# EAGLE design e-wall (EAGLE 6.4)
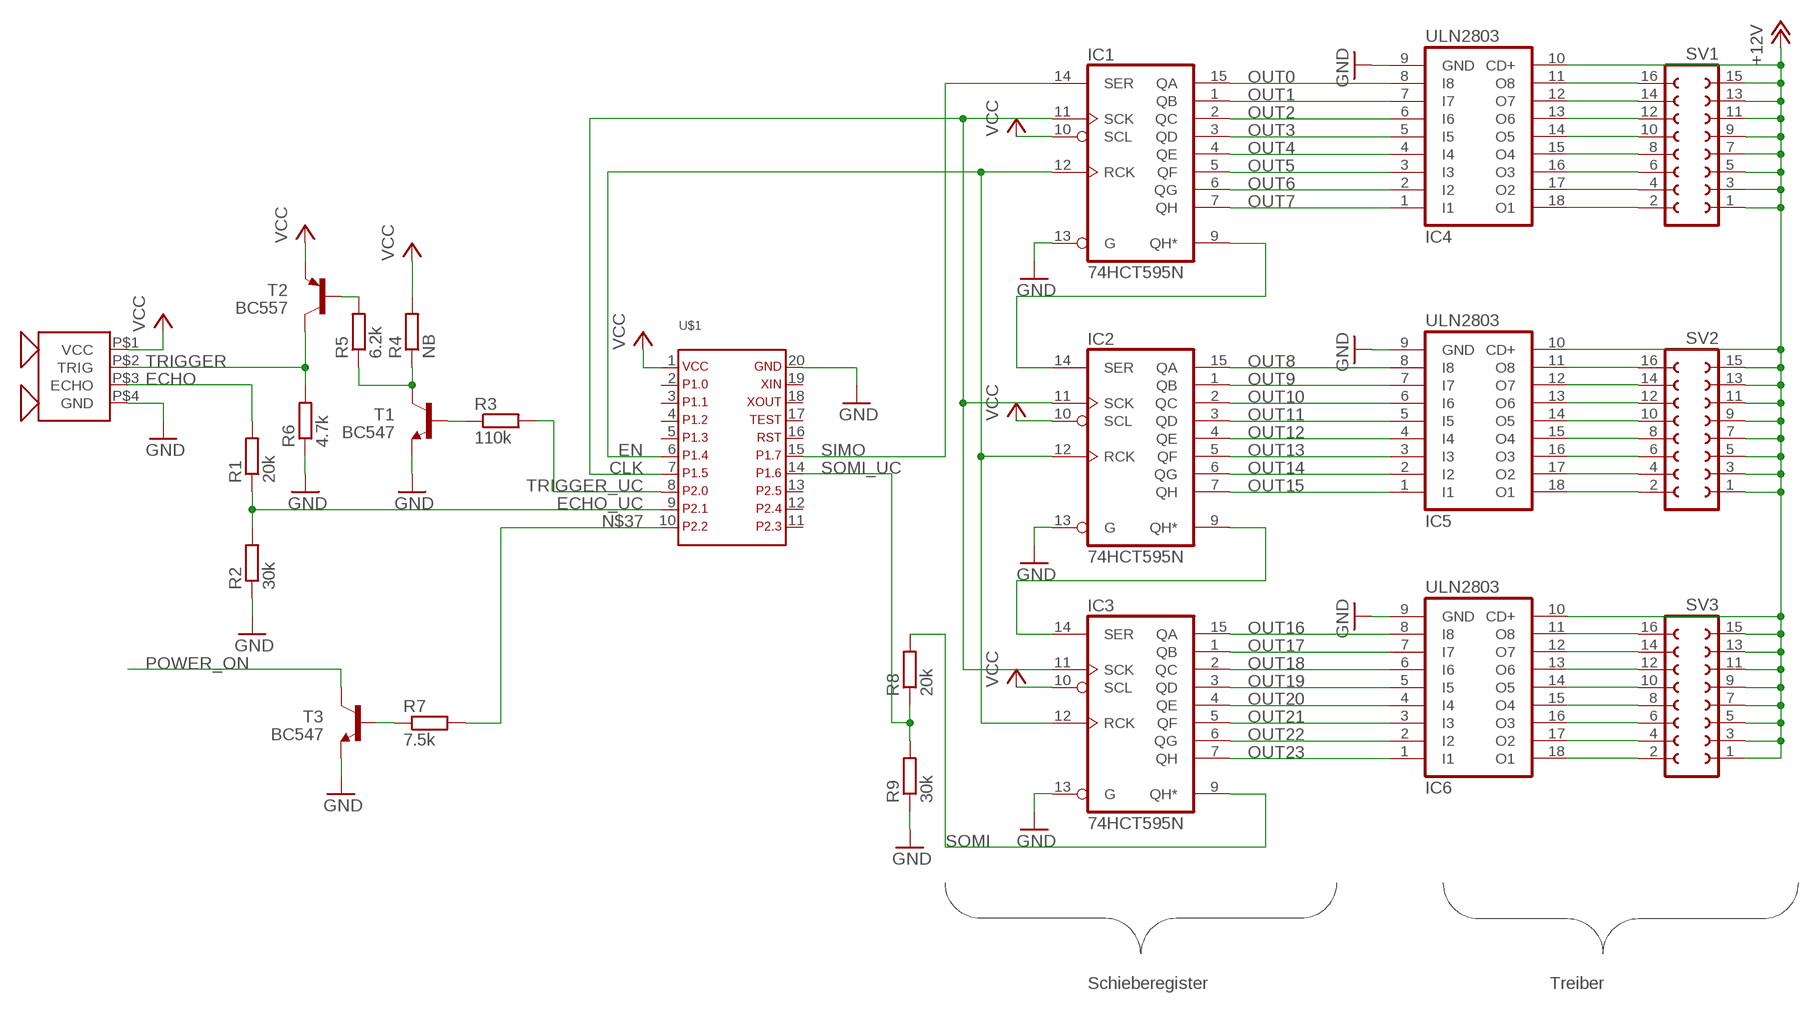
[diagram p0: schematic, sheet 1]

## Parts
IC1  74HCT595N  [DIL16]
IC2  74HCT595N  [DIL16]
IC3  74HCT595N  [DIL16]
IC4  ULN2803  ULN2803A  [DIL18]
IC5  ULN2803  ULN2803A  [DIL18]
IC6  ULN2803  ULN2803A  [DIL18]
R1  20k  R-EU_0207/7  [0207/7]
R2  30k  R-EU_0207/7  [0207/7]
R3  110k  R-EU_0207/7  [0207/7]
R4  NB  R-EU_0207/2V  [0207/2V]
R5  6.2k  R-EU_0207/2V  [0207/2V]
R6  4.7k  R-EU_0207/7  [0207/7]
R7  7.5k  R-EU_0207/7  [0207/7]
R8  20k  R-EU_0207/7  [0207/7]
R9  30k  R-EU_0207/7  [0207/7]
SV1  FE08-2  [FE08-2]
SV2  FE08-2  [FE08-2]
SV3  FE08-2  [FE08-2]
T1  BC547  -NPN-TO92-EBC  [TO92-EBC]
T2  BC557  -PNP-TO92-BEC  [TO92-BEC]
T3  BC547  -NPN-TO92-EBC  [TO92-EBC]
U$1  MSP430LAUNCHPAD_BASIC  [MSP430LAUNCHPAD_BASIC]
U$2  HC-SR04  [HC-SR04]

## Nets
+12V: IC4.10(CD+) IC5.10(CD+) IC6.10(CD+) SV1.1 SV1.3 SV1.5 SV1.7 SV1.9 SV1.11 SV1.13 SV1.15 SV2.1 SV2.3 SV2.5 SV2.7 SV2.9 SV2.11 SV2.13 SV2.15 SV3.1 SV3.3 SV3.5 SV3.7 SV3.9 SV3.11 SV3.13 SV3.15
CLK: IC1.11(SCK) IC2.11(SCK) IC3.11(SCK) U$1.7
ECHO: R1.2 U$2.P$3(ECHO)
ECHO_UC: R1.1 R2.2 U$1.9
EN: IC1.12(RCK) IC2.12(RCK) IC3.12(RCK) U$1.6
GND: IC1.13(G) IC2.13(G) IC3.13(G) IC4.9(GND) IC5.9(GND) IC6.9(GND) R2.1 R6.1 R9.1 T1.E T3.E U$1.20 U$2.P$4(GND)
N$1: IC1.9(QH*) IC2.14(SER)
N$2: IC2.9(QH*) IC3.14(SER)
N$3: IC6.18(O1) SV3.2
N$4: IC6.17(O2) SV3.4
N$5: IC6.16(O3) SV3.6
N$6: IC6.15(O4) SV3.8
N$7: IC6.14(O5) SV3.10
N$8: IC6.13(O6) SV3.12
N$9: IC6.12(O7) SV3.14
N$10: IC6.11(O8) SV3.16
N$11: IC5.18(O1) SV2.2
N$12: IC5.17(O2) SV2.4
N$13: IC5.16(O3) SV2.6
N$14: IC5.15(O4) SV2.8
N$15: IC5.14(O5) SV2.10
N$16: IC5.13(O6) SV2.12
N$17: IC5.12(O7) SV2.14
N$18: IC5.11(O8) SV2.16
N$19: IC4.18(O1) SV1.2
N$20: IC4.17(O2) SV1.4
N$21: IC4.16(O3) SV1.6
N$22: IC4.15(O4) SV1.8
N$23: IC4.14(O5) SV1.10
N$24: IC4.13(O6) SV1.12
N$25: IC4.12(O7) SV1.14
N$26: IC4.11(O8) SV1.16
N$33: R3.1 T1.B
N$34: R4.1 R5.1 T1.C
N$35: R5.2 T2.B
N$36: R7.1 T3.B
N$37: R7.2 U$1.10
OUT0: IC1.15(QA) IC4.8(I8)
OUT1: IC1.1(QB) IC4.7(I7)
OUT2: IC1.2(QC) IC4.6(I6)
OUT3: IC1.3(QD) IC4.5(I5)
OUT4: IC1.4(QE) IC4.4(I4)
OUT5: IC1.5(QF) IC4.3(I3)
OUT6: IC1.6(QG) IC4.2(I2)
OUT7: IC1.7(QH) IC4.1(I1)
OUT8: IC2.15(QA) IC5.8(I8)
OUT9: IC2.1(QB) IC5.7(I7)
OUT10: IC2.2(QC) IC5.6(I6)
OUT11: IC2.3(QD) IC5.5(I5)
OUT12: IC2.4(QE) IC5.4(I4)
OUT13: IC2.5(QF) IC5.3(I3)
OUT14: IC2.6(QG) IC5.2(I2)
OUT15: IC2.7(QH) IC5.1(I1)
OUT16: IC3.15(QA) IC6.8(I8)
OUT17: IC3.1(QB) IC6.7(I7)
OUT18: IC3.2(QC) IC6.6(I6)
OUT19: IC3.3(QD) IC6.5(I5)
OUT20: IC3.4(QE) IC6.4(I4)
OUT21: IC3.5(QF) IC6.3(I3)
OUT22: IC3.6(QG) IC6.2(I2)
OUT23: IC3.7(QH) IC6.1(I1)
POWER_ON: T3.C
SIMO: IC1.14(SER) U$1.15
SOMI: IC3.9(QH*) R8.2
SOMI_UC: R8.1 R9.2 U$1.14
TRIGGER: R6.2 T2.C U$2.P$2(TRIG)
TRIGGER_UC: R3.2 U$1.8
VCC: IC1.10(SCL) IC2.10(SCL) IC3.10(SCL) R4.2 T2.E U$1.1 U$2.P$1(VCC)
Unconnected: U$1.2 U$1.3 U$1.4 U$1.5 U$1.11 U$1.12 U$1.13 U$1.16 U$1.17 U$1.18 U$1.19

## Notes on the sheet
- Schieberegister | Treiber

## Power pins joined to a net without a drawn wire
GND: IC1.8(GND) IC2.8(GND) IC3.8(GND)
VCC: IC1.16(VCC) IC2.16(VCC) IC3.16(VCC)

## Library data of the parts
IC1-IC3 = 74xx-eu:74*595: 8-bit SHIFT REGISTER, output latch
IC4-IC6 = uln-udn:ULN2803A: DRIVER ARRAY
R1-R9 = resistor:R-EU_: RESISTOR, European symbol
SV1-SV3 = con-lsta:FE08-2: FEMALE HEADER; OC_FARNELL: unknown; OC_NEWARK: unknown
T1 T3 = transistor:*-NPN-: NPN Transistror BF959 corrected 2008.03.06
T2 = transistor:*-PNP-: PNP Transistror
U$1 = msp430launchpad:MSP430LAUNCHPAD_BASIC
U$2 = ultrasonic:HC-SR04

## Board
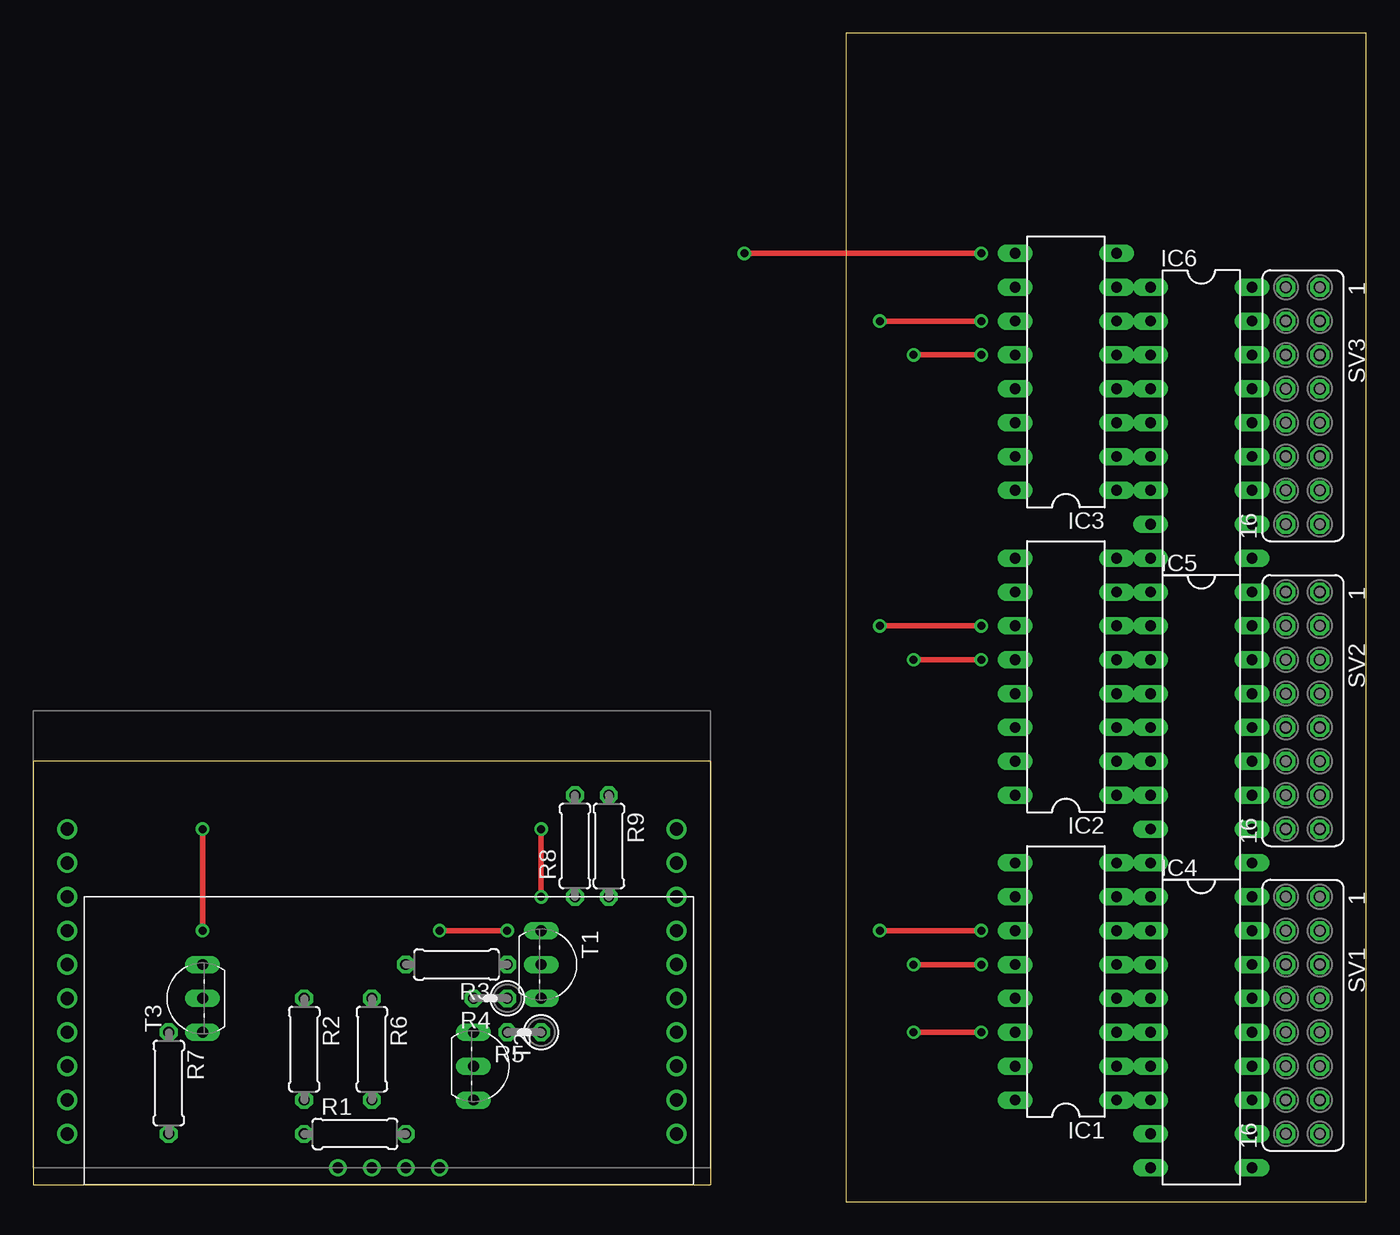
[diagram p1: board, top side]
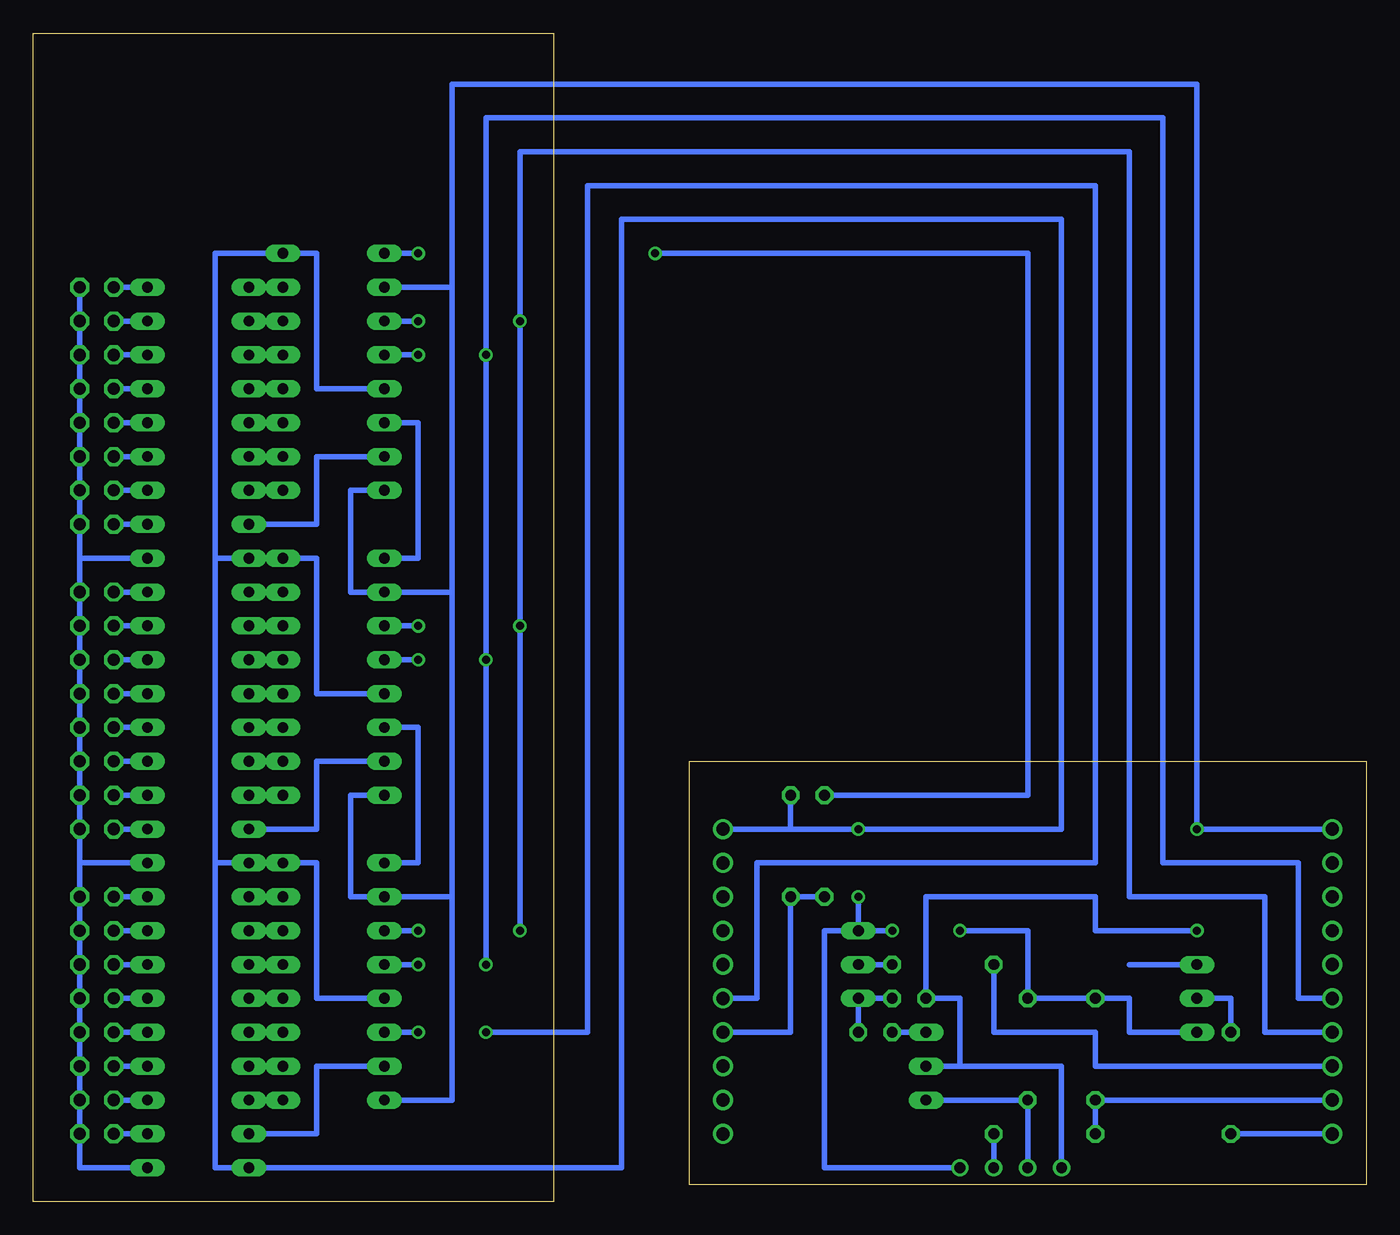
[diagram p2: board, bottom side, seen from below]

Size 100 x 87.62 mm. Coordinates in mm from the lower left corner, seen from the top.
Outline: 60.96,0 100,0 100,87.62 60.96,87.62 60.96,0
Outline: 50.8,33.02 0,33.02 0,1.27 50.8,1.27 50.8,33.02
Copper layers (1*16): Top 0.035mm / dielectric 1.5mm / Bottom 0.035mm
Design rules "default *": minimum track width 10mil, minimum drill 23mil, track to track 8mil, track to pad 8mil, pad to pad 8mil, via to via 8mil, smd to smd 8mil, copper to edge 20mil, drill to drill 8mil, minimum pad ring 10mil, minimum via ring 8mil, stop-mask expansion 4mil, vias tented up to drill 0mil, thermal gap 10mil

### Footprints (pad centres in the part's own frame; a part is rotated, then mirrored left to right if it is on the bottom)
DIL16 = drill 0.813 long: 1 -8.89,-3.81; 2 -6.35,-3.81; 3 -3.81,-3.81; 4 -1.27,-3.81; 5 1.27,-3.81; 6 3.81,-3.81; 7 6.35,-3.81; 8 8.89,-3.81; 9 8.89,3.81; 10 6.35,3.81; 11 3.81,3.81; 12 1.27,3.81; 13 -1.27,3.81; 14 -3.81,3.81; 15 -6.35,3.81; 16 -8.89,3.81
DIL18 = drill 0.813 long: 1 -10.16,-3.81; 2 -7.62,-3.81; 3 -5.08,-3.81; 4 -2.54,-3.81; 5 0,-3.81; 6 2.54,-3.81; 7 5.08,-3.81; 8 7.62,-3.81; 9 10.16,-3.81; 10 10.16,3.81; 11 7.62,3.81; 12 5.08,3.81; 13 2.54,3.81; 14 0,3.81; 15 -2.54,3.81; 16 -5.08,3.81; 17 -7.62,3.81; 18 -10.16,3.81
0207/7 = drill 0.813 octagon: 1 -3.81,0; 2 3.81,0
0207/2V = drill 0.813 octagon: 1 -1.27,0; 2 1.27,0
FE08-2 = drill 0.914 octagon: 1 -8.89,1.27; 2 -8.89,-1.27; 3 -6.35,1.27; 4 -6.35,-1.27; 5 -3.81,1.27; 6 -3.81,-1.27; 7 -1.27,1.27; 8 -1.27,-1.27; 9 1.27,1.27; 10 1.27,-1.27; 11 3.81,1.27; 12 3.81,-1.27; 13 6.35,1.27; 14 6.35,-1.27; 15 8.89,1.27; 16 8.89,-1.27
TO92-EBC = drill 0.813 long: B 0,-1.27; C 2.54,-1.27; E -2.54,-1.27
TO92-BEC = drill 0.813 long: B -2.54,0; C 2.54,0; E 0,0
MSP430LAUNCHPAD_BASIC = drill 1: 1 -22.86,11.43; 2 -22.86,8.89; 3 -22.86,6.35; 4 -22.86,3.81; 5 -22.86,1.27; 6 -22.86,-1.27; 7 -22.86,-3.81; 8 -22.86,-6.35; 9 -22.86,-8.89; 10 -22.86,-11.43; 11 22.86,-11.43; 12 22.86,-8.89; 13 22.86,-6.35; 14 22.86,-3.81; 15 22.86,-1.27; 16 22.86,1.27; 17 22.86,3.81; 18 22.86,6.35; 19 22.86,8.89; 20 22.86,11.43
HC-SR04 = drill 0.8: P$1 -3.81,0; P$2 -1.27,0; P$3 1.27,0; P$4 3.81,0

### Placement (x,y rotation side)
IC1  77.47,16.51 90 top
IC2  77.47,39.37 90 top
IC3  77.47,62.23 90 top
IC4  87.63,12.7 270 top
IC5  87.63,35.56 270 top
IC6  87.63,58.42 270 top
R1  24.13,5.08 0 top
R2  20.32,11.43 270 top
R3  31.75,17.78 180 top
R4  34.29,15.24 180 top
R5  36.83,12.7 180 top
R6  25.4,11.43 270 top
R7  10.16,8.89 270 top
R8  40.64,26.67 90 top
R9  43.18,26.67 270 top
SV1  95.25,13.97 270 top
SV2  95.25,36.83 270 top
SV3  95.25,59.69 270 top
T1  39.37,17.78 270 top
T2  33.02,10.16 270 top
T3  11.43,15.24 90 top
U$1  25.4,16.51 0 top
U$2  26.67,2.54 0 top

### Tracks (layer width: path | path; a pad name or v marks a point on that pad's centre or on a via)
+12V
  Bottom 0.406: IC6.10 96.52,48.26 | 96.52,48.26 SV3.15 SV3.13 SV3.11 SV3.9 SV3.7 SV3.5 SV3.3 SV3.1 | IC5.10 96.52,25.4 | 96.52,25.4 SV2.15 SV2.13 SV2.11 SV2.9 SV2.7 SV2.5 SV2.3 SV2.1 96.52,48.26 | 96.52,25.4 SV1.1 SV1.3 SV1.5 SV1.7 SV1.9 SV1.11 SV1.13 SV1.15 96.52,2.54 IC4.10
CLK  (via drill 0.6)
  Top 0.406: v71.12,43.18 v63.5,43.18 | v63.5,20.32 v71.12,20.32 | v71.12,66.04 v63.5,66.04
  Bottom 0.406: IC2.11 v71.12,43.18 | v63.5,20.32 v63.5,43.18 v63.5,66.04 63.5,78.74 17.78,78.74 17.78,22.86 7.62,22.86 7.62,12.7 U$1.7 | v71.12,20.32 IC1.11 | IC3.11 v71.12,66.04
ECHO
  Bottom 0.406: U$2.P$3 R1.2
ECHO_UC
  Bottom 0.406: R1.1 R2.2 U$1.9
EN  (via drill 0.6)
  Top 0.406: v71.12,40.64 v66.04,40.64 | v66.04,17.78 v71.12,17.78 | v71.12,63.5 v66.04,63.5
  Bottom 0.406: IC2.12 v71.12,40.64 | IC1.12 v71.12,17.78 | v66.04,17.78 v66.04,40.64 v66.04,63.5 66.04,81.28 15.24,81.28 15.24,25.4 5.08,25.4 5.08,15.24 U$1.6 | IC3.12 v71.12,63.5
GND  (via drill 0.6)
  Top 0.406: v38.1,22.86 v38.1,27.94 | v30.48,20.32 v35.56,20.32
  Bottom 0.406: 86.36,48.26 IC6.9 IC2.8 78.74,48.26 78.74,38.1 IC2.13 | 86.36,48.26 86.36,71.12 IC3.8 78.74,71.12 78.74,60.96 IC3.13 | 86.36,25.4 IC5.9 IC1.8 78.74,25.4 78.74,15.24 IC1.13 | 86.36,48.26 86.36,25.4 | 86.36,25.4 86.36,2.54 IC4.9 55.88,2.54 55.88,73.66 22.86,73.66 22.86,27.94 v38.1,27.94 43.18,27.94 | 43.18,27.94 R9.1 | U$2.P$4 40.64,2.54 40.64,20.32 T1.E | T3.E 17.78,12.7 17.78,15.24 R2.1 R6.1 25.4,20.32 v30.48,20.32 | v35.56,20.32 T1.E | T1.E v38.1,22.86 | U$1.20 43.18,27.94
N$1
  Bottom 0.406: IC1.9 71.12,25.4 71.12,35.56 IC2.14
N$2
  Bottom 0.406: IC2.9 71.12,48.26 71.12,58.42 IC3.14
N$3
  Bottom 0.406: IC6.18 SV3.2
N$4
  Bottom 0.406: IC6.17 SV3.4
N$5
  Bottom 0.406: SV3.6 IC6.16
N$6
  Bottom 0.406: SV3.8 IC6.15
N$7
  Bottom 0.406: IC6.14 SV3.10
N$8
  Bottom 0.406: IC6.13 SV3.12
N$9
  Bottom 0.406: IC6.12 SV3.14
N$10
  Bottom 0.406: IC6.11 SV3.16
N$11
  Bottom 0.406: IC5.18 SV2.2
N$12
  Bottom 0.406: IC5.17 SV2.4
N$13
  Bottom 0.406: IC5.16 SV2.6
N$14
  Bottom 0.406: IC5.15 SV2.8
N$15
  Bottom 0.406: IC5.14 SV2.10
N$16
  Bottom 0.406: IC5.13 SV2.12
N$17
  Bottom 0.406: IC5.12 SV2.14
N$18
  Bottom 0.406: IC5.11 SV2.16
N$19
  Bottom 0.406: IC4.18 SV1.2
N$20
  Bottom 0.406: IC4.17 SV1.4
N$21
  Bottom 0.406: IC4.16 SV1.6
N$22
  Bottom 0.406: SV1.8 IC4.15
N$23
  Bottom 0.406: IC4.14 SV1.10
N$24
  Bottom 0.406: SV1.12 IC4.13
N$25
  Bottom 0.406: IC4.12 SV1.14
N$26
  Bottom 0.406: IC4.11 SV1.16
N$33
  Bottom 0.406: T1.B R3.1
N$34
  Bottom 0.406: R5.1 T1.C R4.1
N$35
  Bottom 0.406: R5.2 T2.B
N$36
  Bottom 0.406: R7.1 10.16,15.24 T3.B
N$37
  Bottom 0.406: U$1.10 R7.2
OUT0
  Bottom 0.406: IC1.15 78.74,10.16 78.74,5.08 IC4.8
OUT1
  Bottom 0.406: IC4.7 IC1.1
OUT2
  Bottom 0.406: IC1.2 IC4.6
OUT3
  Bottom 0.406: IC1.3 IC4.5
OUT4
  Bottom 0.406: IC1.4 IC4.4
OUT5
  Bottom 0.406: IC1.5 IC4.3
OUT6
  Bottom 0.406: IC1.6 IC4.2
OUT7
  Bottom 0.406: IC1.7 IC4.1
OUT8
  Bottom 0.406: IC2.15 78.74,33.02 78.74,27.94 IC5.8
OUT9
  Bottom 0.406: IC2.1 IC5.7
OUT10
  Bottom 0.406: IC5.6 IC2.2
OUT11
  Bottom 0.406: IC2.3 IC5.5
OUT12
  Bottom 0.406: IC5.4 IC2.4
OUT13
  Bottom 0.406: IC2.5 IC5.3
OUT14
  Bottom 0.406: IC5.2 IC2.6
OUT15
  Bottom 0.406: IC5.1 IC2.7
OUT16
  Bottom 0.406: IC3.15 78.74,55.88 78.74,50.8 IC6.8
OUT17
  Bottom 0.406: IC3.1 IC6.7
OUT18
  Bottom 0.406: IC3.2 IC6.6
OUT19
  Bottom 0.406: IC3.3 IC6.5
OUT20
  Bottom 0.406: IC3.4 IC6.4
OUT21
  Bottom 0.406: IC3.5 IC6.3
OUT22
  Bottom 0.406: IC3.6 IC6.2
OUT23
  Bottom 0.406: IC3.7 IC6.1
POWER_ON
  Bottom 0.406: T3.C 17.78,17.78
SIMO  (via drill 0.6)
  Top 0.406: v71.12,12.7 v66.04,12.7
  Bottom 0.406: IC1.14 v71.12,12.7 | v66.04,12.7 58.42,12.7 58.42,76.2 20.32,76.2 20.32,25.4 45.72,25.4 45.72,15.24 U$1.15
SOMI  (via drill 0.6)
  Top 0.406: v71.12,71.12 v53.34,71.12
  Bottom 0.406: IC3.9 v71.12,71.12 | v53.34,71.12 25.4,71.12 25.4,30.48 R8.2
SOMI_UC
  Bottom 0.406: R8.1 R9.2 43.18,12.7 U$1.14
TRIGGER
  Bottom 0.406: U$2.P$2 R6.2 T2.C
TRIGGER_UC
  Bottom 0.406: U$1.8 20.32,10.16 20.32,12.7 27.94,12.7 R3.2
VCC  (via drill 0.6)
  Top 0.406: v12.7,27.94 v12.7,20.32
  Bottom 0.406: IC3.16 76.2,53.34 76.2,45.72 IC2.10 68.58,45.72 | IC2.16 76.2,30.48 76.2,22.86 IC1.10 68.58,22.86 | IC1.16 68.58,7.62 68.58,22.86 | 68.58,68.58 68.58,83.82 12.7,83.82 v12.7,27.94 U$1.1 | 68.58,68.58 68.58,45.72 | 68.58,45.72 68.58,22.86 | IC3.10 68.58,68.58 | 30.48,10.16 22.86,10.16 U$2.P$1 | v12.7,20.32 20.32,20.32 20.32,22.86 33.02,22.86 R4.2 30.48,15.24 30.48,10.16 | 30.48,10.16 T2.E